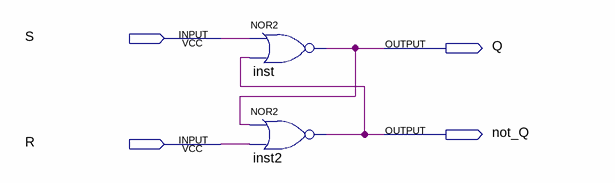
[diagram p0: schematic sheet]
// Quartus schematic RS.bdf as structural Verilog: 2 symbols, 4 pins
module RS (
  input  S,
  input  R,
  output Q,
  output not_Q
);

  nor inst (Q, S, not_Q);
  nor inst2 (not_Q, Q, R);
endmodule
